# Altium schematic sheet Sheet1.SchDoc
size A
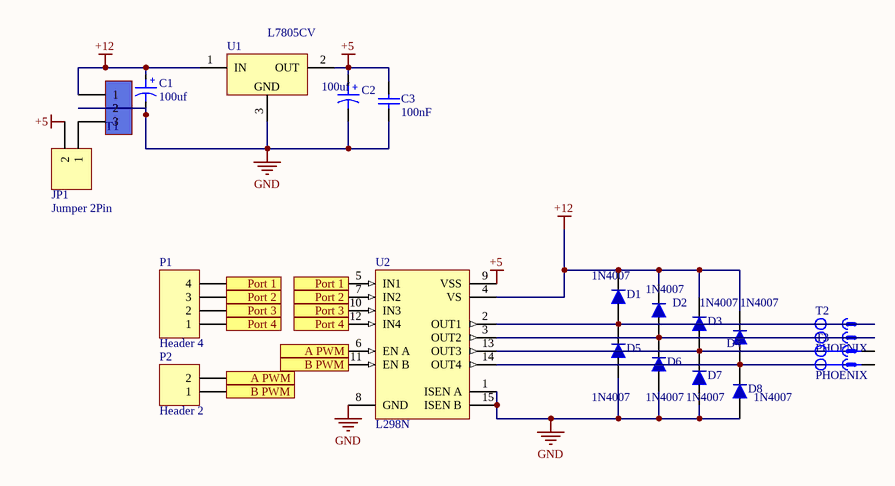
[diagram p0: Sheet1.SchDoc]

## Parts
C1  100uf  [Cap electrolitic radial 8x14-3.5]
C2  100uf  [Cap electrolitic radial 8x14-3.5]
C3  100nF  [Cap-100nF]
D1  1N4007  [Diode 1n4007]
D2  1N4007  [Diode 1n4007]
D3  1N4007  [Diode 1n4007]
D4  1N4007  [Diode 1n4007]
D5  1N4007  [Diode 1n4007]
D6  1N4007  [Diode 1n4007]
D7  1N4007  [Diode 1n4007]
D8  1N4007  [Diode 1n4007]
JP1  Jumper 2Pin  [Jumper Small - 2.54 - Blue]
P1  Header 4  [HDR1X4]
P2  Header 2  [HDR1X2]
T1  Terminal  [Terminal 1*3]  (value not drawn)
T2  PHOENIX  [MSTB 2,5/2-G]
T3  PHOENIX  [MSTB 2,5/2-G]
U1  L7805CV  [78XXCV]
U2  L298N  [Multiwatt15V]

## Ports
A PWM, B PWM, Port 1, Port 2, Port 3, Port 4

## Nets
+5: C2.1 C3.2 JP1.2 U1.2(OUT) U2.9(VSS)
+12: C1.1 D1.2 D2.2 D3.2 D4.2 T1.1 U1.1(IN) U2.4(VS)
GND: C1.2 C2.2 C3.1 D5.1 D6.1 D7.1 D8.1 T1.2 U1.3(GND) U2.1(ISEN_A) U2.8(GND) U2.15(ISEN_B)
A PWM: P2.2 U2.6(EN_A) ; port A PWM
B PWM: P2.1 U2.11(EN_B) ; port B PWM
Port 1: P1.4 U2.5(IN1) ; port Port 1
Port 2: P1.3 U2.7(IN2) ; port Port 2
Port 3: P1.2 U2.10(IN3) ; port Port 3
Port 4: P1.1 U2.12(IN4) ; port Port 4
NetD1_1: D1.1 D5.2 T2.2 U2.2(OUT1)
NetD2_1: D2.1 D6.2 T2.1 U2.3(OUT2)
NetD3_1: D3.1 D7.2 T3.2 U2.13(OUT3)
NetD4_1: D4.1 D8.2 T3.1 U2.14(OUT4)
NetJP1_1: JP1.1 T1.3

## Notes on the sheet
- (in symbol Cap ELECTROLITIC TOTAL SIZE) +

## Library data of the parts
C1 C2 = Cap ELECTROLITIC TOTAL SIZE: Cap electrolitic radial; Designer: Abbas Basereh; VALUE: 1uF; Data: 16-12-2016; Part. No: *
C3 = CAP CERAMIC TOTAL SIZE: CAP Ceramic Total; Designer: Ali Hafizi
D1-D8 = Diode DIP Package: Published: 8-Jun-2000; LatestRevisionDate: 17-Jul-2002; LatestRevisionNote: Re-released for DXP Platform.; DatasheetVersion: 1997; Publisher: Altium Limited; PackageDescription: Diode, Axial; Body 3.8 x 1.9 mm (LxDia. max), Lead Dia. 0.53 mm (max); Code_JEDEC: DO-204-AH; ComponentLink1Description: Manufacturer Link; ComponentLink1URL: http://www.fairchildsemi.com/; ComponentLink2Description: Datasheet; ComponentLink2URL: http://www.fairchildsemi.com/ds/1N%2F1N4148.pdf
JP1 = Jumper 2Pin: Jumper, 2-Pin; Designer: Abbas Basereh; Data: 16-12-2016; Link: *
P1 = Header 4: Header, 4-Pin; LatestRevisionDate: 17-Jul-2002; LatestRevisionNote: Re-released for DXP Platform.; Publisher: Altium Limited
P2 = Header 2: Header, 2-Pin; LatestRevisionDate: 17-Jul-2002; LatestRevisionNote: Re-released for DXP Platform.; Publisher: Altium Limited
T1 = Terminal 1*3: Terminal 3 Pin 250VAC 16A; Designer: Seyed Mohsen Ghasemain; E-mail: picpars@gmail.com; ComponentLinkURL: www.picpars.com
T2 T3 = CON_Phoenix_MSTB_02: 2 Pitch: 5.08 mm Color: green Contact surface: Tin Assembly; Manufacturer: PHOENIX CONTACT; Connector type: PCB Terminal Block; designer: ABBAS BASEREH; Max Current: 12 A; Positions: 2; Voltage: 320 V; Category: Connector; ComponentLink1Description: Header, Nominal current: 12 A Rated voltage (III/2): 320 V Number of positions: 2 Pitch: 5.08 mm Color: green Contact surface: Tin Assembly: Soldering  DESIGNER:ABBAS BASEREH; ComponentLink2Description: Reference; Mounting Technology: Through-Hole; Pin Count: 2; Revision 1: 2017-3-1; Status: Unreleased; PART.NO: PHOENIX
U1 = L78XXCV: Fixed Voltage Regulator; Designer: Saeid Jorablo; Company: ControTec; Adding Date: 1387/01/06; Voltage: *
U2 = L298N: Dual Full Bridge Driver; Revision 1: 24-Aug-2001: Footprint Added.; Revision 2: 17-Jul-2002: Re-released for DXP Platform.; Package Information: Latest Revision: Apr-1998; Published: 8-Jun-2000; Datasheet: Latest Revision: Jul-1999; Package Reference: Multiwatt15H; Publisher: Altium Limited